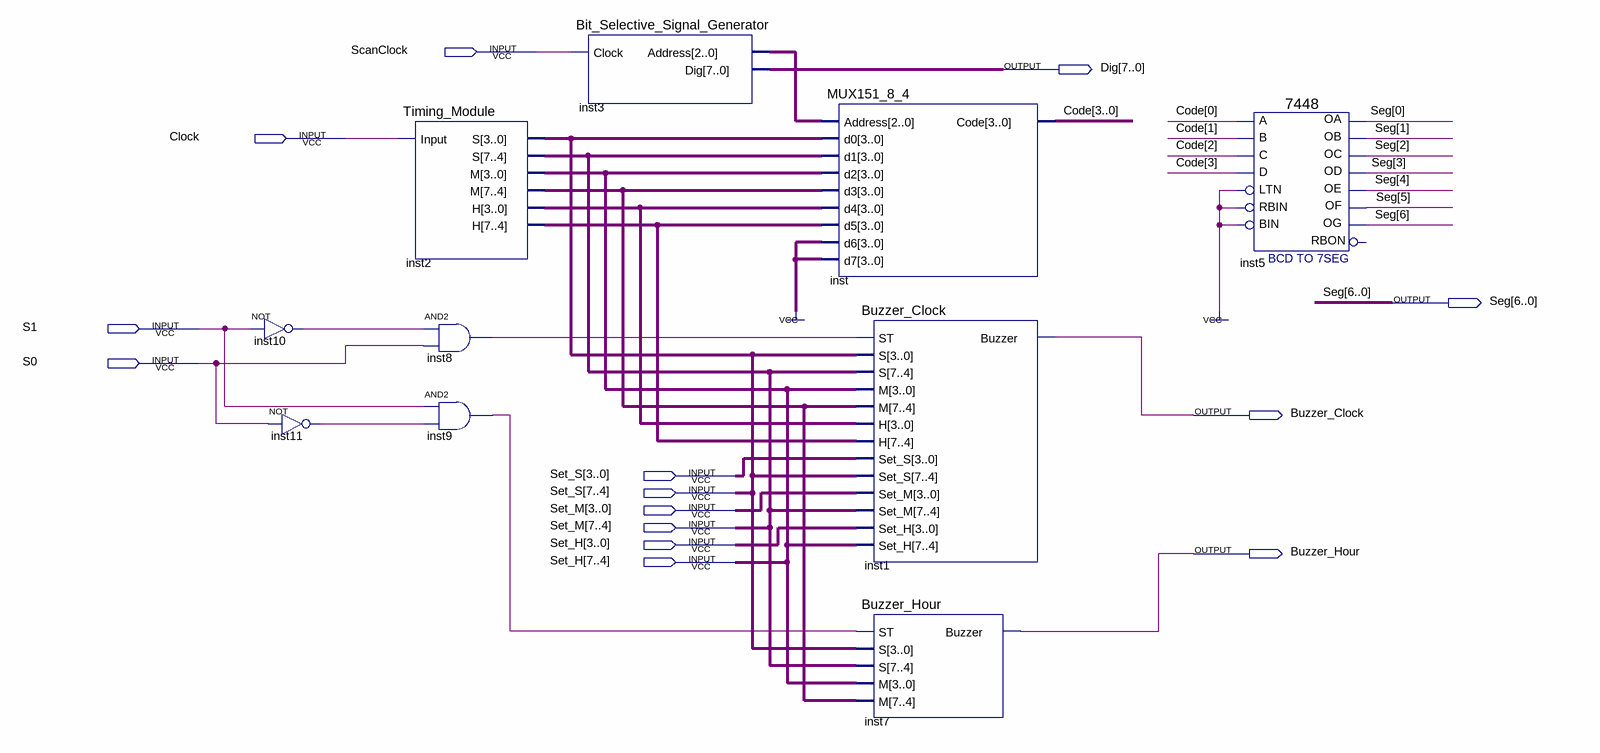
[diagram p0: schematic sheet]
// Quartus schematic DigitalClock.bdf as structural Verilog: 10 symbols, 14 pins
module DigitalClock (
  input  ScanClock,
  input  Clock,
  input  S1,
  input  S0,
  input  [7:0] Set_S,
  input  [7:0] Set_M,
  input  [7:0] Set_H,
  output [7:0] Dig,
  output [6:0] Seg,
  output Buzzer_Clock,
  output Buzzer_Hour
);

  wire inst8_out, inst9_out, inst10_out, inst11_out;
  wire [2:0] inst3_address;
  wire [3:0] Code, inst2_h, inst2_h_2, inst2_m;

  not inst10 (inst10_out, S1);
  not inst11 (inst11_out, S0);
  Timing_Module inst2 (
    .Input(Clock), .S({Set_M[7:4], Set_S[7:4]}), .M({inst2_m, Set_H[7:4]}), .H({inst2_h_2, inst2_h}));
  and inst8 (inst8_out, inst10_out, S0);
  and inst9 (inst9_out, S1, inst11_out);
  Bit_Selective_Signal_Generator inst3 (.Clock(ScanClock), .Address(inst3_address), .Dig(Dig));
  MUX151_8_4 inst (
    .Address(inst3_address), .d0(Set_S[7:4]), .d1(Set_M[7:4]), .d2(Set_H[7:4]), .d3(inst2_m), .d4(inst2_h),
    .d5(inst2_h_2), .d6(4'b1111), .d7(4'b1111), .Code(Code));
  Buzzer_Clock inst1 (
    .ST(inst8_out), .S({Set_M[7:4], Set_S[7:4]}), .M({inst2_m, Set_H[7:4]}), .H({inst2_h_2, inst2_h}),
    .Set_S(Set_S), .Set_M(Set_M), .Set_H(Set_H), .Buzzer(Buzzer_Clock));
  Buzzer_Hour inst7 (.ST(inst9_out), .S({Set_M[7:4], Set_S[7:4]}), .M({inst2_m, Set_H[7:4]}), .Buzzer(Buzzer_Hour));
  \7448  inst5 (
    .A(Code[0]), .C(Code[2]), .D(Code[3]), .B(Code[1]), .RBIN(1'b1), .BIN(1'b1), .LTN(1'b1), .OC(Seg[2]),
    .OE(Seg[4]), .OD(Seg[3]), .OF(Seg[5]), .OG(Seg[6]), .OB(Seg[1]), .OA(Seg[0]));  // open: RBON
endmodule
